# EasyEDA schematic Oasis embedded system_2020-12-29_17-35-10.json
TITLE: Oasis embedded system; REV: 1.0; Date: 2020-12-29; Sheet: 1/1; Company: Babilonia
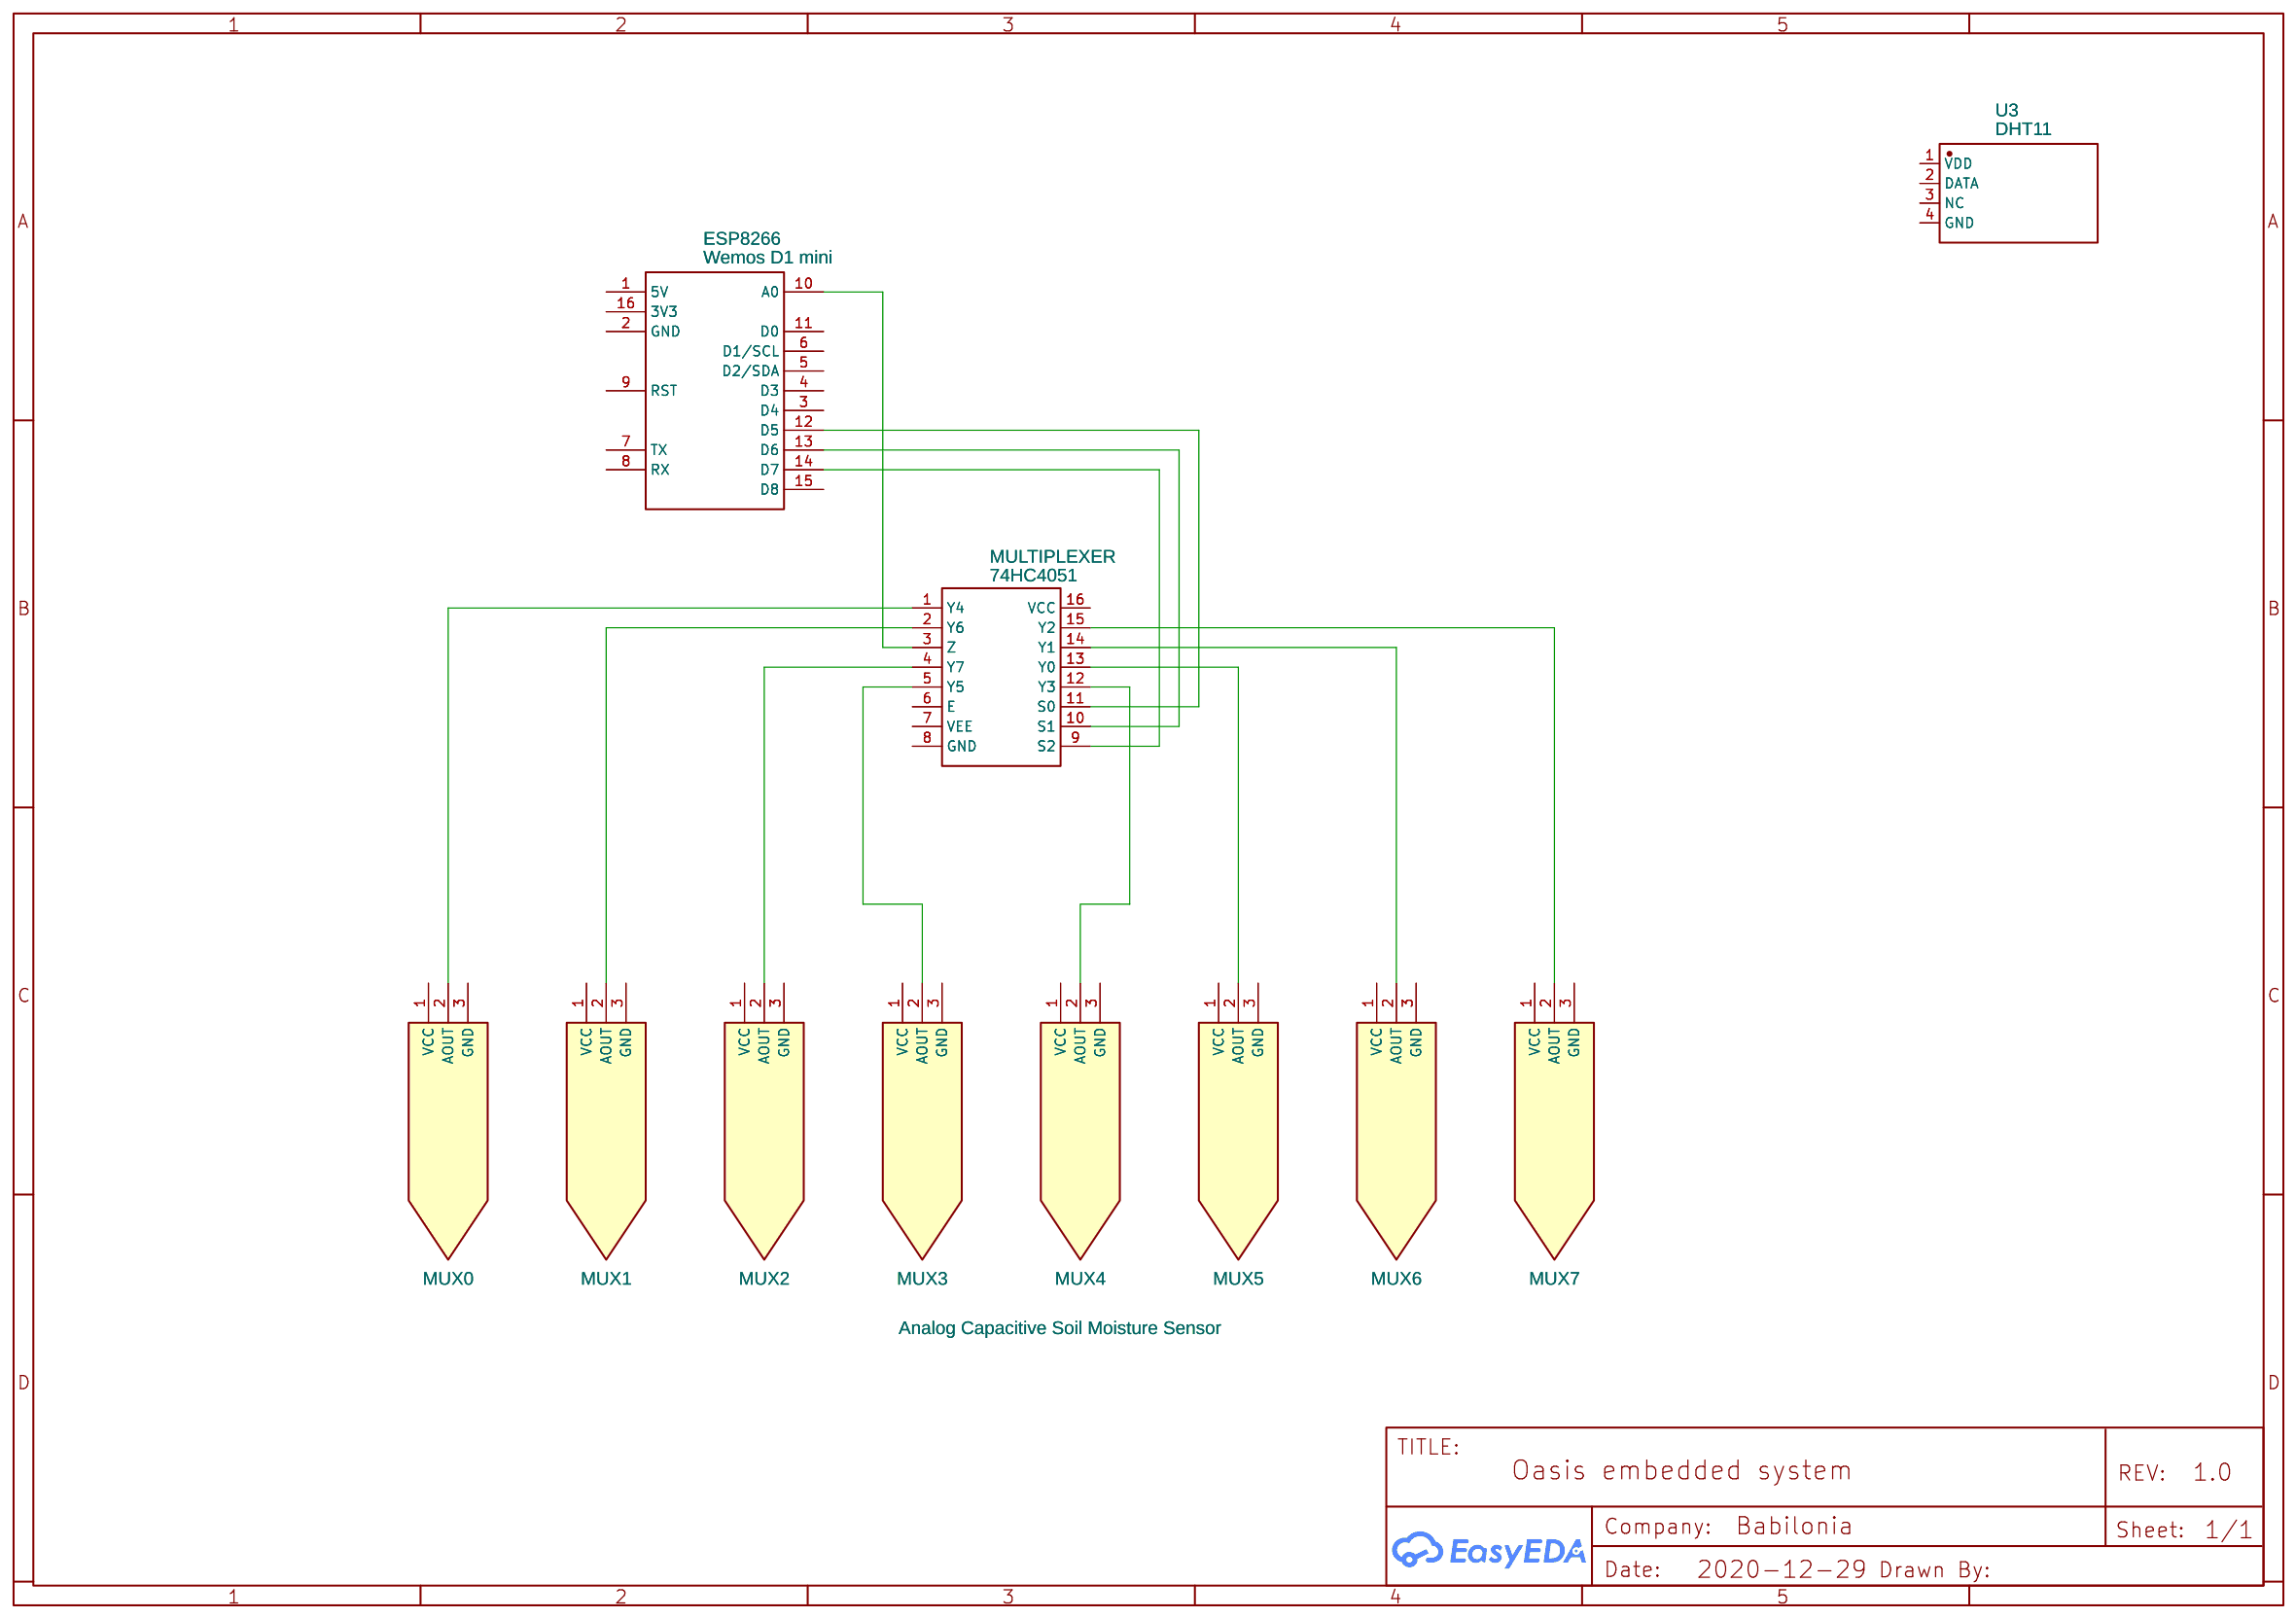
[diagram p0: schematic sheet]

## Parts
ESP8266  Wemos D1 mini  [WEMOS D1 MINI]
MULTIPLEXER  74HC4051
MUX0  Analog Capacitive Soil Moisture Sensor
MUX1  Analog Capacitive Soil Moisture Sensor
MUX2  Analog Capacitive Soil Moisture Sensor
MUX3  Analog Capacitive Soil Moisture Sensor
MUX4  Analog Capacitive Soil Moisture Sensor
MUX5  Analog Capacitive Soil Moisture Sensor
MUX6  Analog Capacitive Soil Moisture Sensor
MUX7  Analog Capacitive Soil Moisture Sensor
U3  DHT11  [SENSOR-TH_DHT11]

## Library data of the parts
ESP8266 = Wemos D1 mini: Contributor: redstar2k
MULTIPLEXER = 74HC4051: Contributor: Fitopy
MUX0-MUX7 = Analog Capacitive Soil Moisture Sensor: Manufacturer Part: New SchematicLib; Contributor: Dmitry Natkha
U3 = DHT11: Supplier: LCSC; Supplier Part: C117051; Manufacturer: Aosong (Guangzhou) Elec; Contributor: LCSC

## Nets
Net-(ESP8266-10): ESP8266.10(A0) MULTIPLEXER.3(Z)
Net-(ESP8266-12): ESP8266.12(D5) MULTIPLEXER.11(S0)
Net-(ESP8266-13): ESP8266.13(D6) MULTIPLEXER.10(S1)
Net-(ESP8266-14): ESP8266.14(D7) MULTIPLEXER.9(S2)
Net-(MULTIPLEXER-1): MULTIPLEXER.1(Y4) MUX0.2(AOUT)
Net-(MULTIPLEXER-2): MULTIPLEXER.2(Y6) MUX1.2(AOUT)
Net-(MULTIPLEXER-4): MULTIPLEXER.4(Y7) MUX2.2(AOUT)
Net-(MULTIPLEXER-5): MULTIPLEXER.5(Y5) MUX3.2(AOUT)
Net-(MULTIPLEXER-12): MULTIPLEXER.12(Y3) MUX4.2(AOUT)
Net-(MULTIPLEXER-13): MULTIPLEXER.13(Y0) MUX5.2(AOUT)
Net-(MULTIPLEXER-14): MULTIPLEXER.14(Y1) MUX6.2(AOUT)
Net-(MULTIPLEXER-15): MULTIPLEXER.15(Y2) MUX7.2(AOUT)

Not connected (* = marked no-connect by the designer): ESP8266 1(5V) 2(GND) 3(D4) 4(D3) 5(D2/SDA) 6(D1/SCL) 7(TX) 8(RX) 9(RST) 11(D0) 15(D8) 16(3V3); MULTIPLEXER 6(E) 7(VEE) 8(GND) 16(VCC); MUX0 1(VCC) 3(GND); MUX1 1(VCC) 3(GND); MUX2 1(VCC) 3(GND); MUX3 1(VCC) 3(GND); MUX4 1(VCC) 3(GND); MUX5 1(VCC) 3(GND); MUX6 1(VCC) 3(GND); MUX7 1(VCC) 3(GND); U3 1(VDD) 2(DATA) 3(NC) 4(GND)
